# EAGLE design fb_up_2-4fach_tastsensor (EAGLE 5.00)
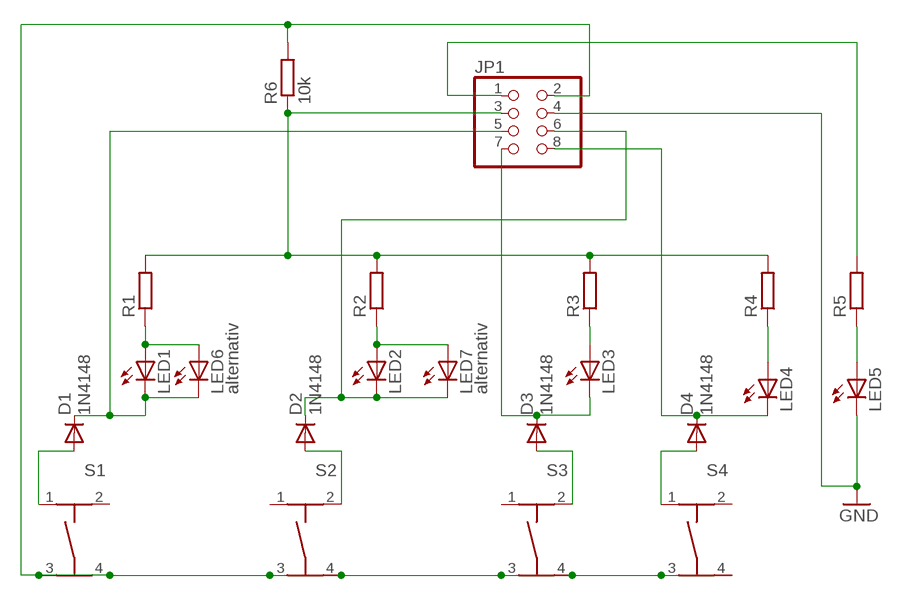
[diagram p0: schematic, sheet 1]

## Parts
D1  1N4148  [DO35-10]
D2  1N4148  [DO35-10]
D3  1N4148  [DO35-10]
D4  1N4148  [DO35-10]
JP1  PINHD-2X4  [2X04]
LED1  LED3MM  [LED3MM]
LED2  LED3MM  [LED3MM]
LED3  LED3MM  [LED3MM]
LED4  LED3MM  [LED3MM]
LED5  LED3MM  [LED3MM]
LED6  alternativ  LED3MM  [LED3MM]
LED7  alternativ  LED3MM  [LED3MM]
R1  R-EU_0204/7  [0204/7]
R2  R-EU_0204/7  [0204/7]
R3  R-EU_0204/7  [0204/7]
R4  R-EU_0204/7  [0204/7]
R5  R-EU_0204/7  [0204/7]
R6  10k  R-EU_0204/7  [0204/7]
S1  TASTER-9314_SMD  [TASTER-9314_SMD]
S2  TASTER-9314_SMD  [TASTER-9314_SMD]
S3  TASTER-9314_SMD  [TASTER-9314_SMD]
S4  TASTER-9314_SMD  [TASTER-9314_SMD]

## Nets
GND: JP1.4 LED5.K(C)
N$4: JP1.1 R5.2
N$5: LED1.A LED6.A R1.1
N$6: LED2.A LED7.A R2.1
N$7: LED3.A R3.1
N$8: LED4.A R4.1
N$9: LED5.A R5.1
N$10: JP1.3 R1.2 R2.2 R3.2 R4.2 R6.1
N$11: D1.C JP1.5 LED1.K(C) LED6.K(C)
N$12: D2.C JP1.6 LED2.K(C) LED7.K(C)
N$13: D1.A S1.1
N$14: D4.C JP1.8 LED4.K(C)
N$15: JP1.2 R6.2 S1.3 S1.4 S2.3 S2.4 S3.3 S3.4 S4.3 S4.4
N$17: D2.A S2.2
N$19: D3.C JP1.7 LED3.K(C)
N$21: D3.A S3.2
N$23: D4.A S4.1
Unconnected: S1.2 S2.1 S3.1 S4.2

## Library data of the parts
D1-D4 = diode:1N4148: DIODE high speed (Philips)
JP1 = pinhead:PINHD-2X4: PIN HEADER
LED1-LED7 = led:LED: LED OSRAM: - CHIPLED LG R971, LG N971, LY N971, LG Q971, LY Q971, LO R971, LY R971 LH N974, LH R974 LS Q976, LO Q976, LY Q976 LO Q996 - Hyper CHIPLED LW Q18S LB Q993, LB Q99A, LB R99A - SideLED LS A670, LO A670, LY A670, LG A670, LP A670 LB A673, LV A673, LT A673, LW A673 LH A674 LY A675 LS A676, LA A676, LO A676, LY A676, LW A676 LS A679, LY A679, LG A679 - Hyper Micro SIDELED® LS Y876, LA Y876, LO Y876, LY Y876 LT Y87S - SmartLED LW L88C, LW L88S LB L89C, LB L89S, LG L890 LS L89K, LO L89K, LY L89K LS L896, LA L896, LO L896, LY L896 - TOPLED LS T670, LO T670, LY T670, LG T670, LP T670 LSG T670, LSP T670, LSY T670, LOP T670, LYG T670 LG T671, LOG T671, LSG T671 LB T673, LV T673, LT T673, LW T673 LH T674 LS T676, LA T676, LO T676, LY T676, LB T676, LH T676, LSB T676, LW T676 LB T67C, LV T67C, LT T67C, LS T67K, LO T67K, LY T67K, LW E67C LS E67B, LA E67B, LO E67B, LY E67B, LB E67C, LV E67C, LT E67C LW T67C LS T679, LY T679, LG T679 LS T770, LO T770, LY T770, LG T770, LP T770 LB T773, LV T773, LT T773, LW T773 LH T774 LS E675, LA E675, LY E675, LS T675 LS T776, LA T776, LO T776, LY T776, LB T776 LHGB T686 LT T68C, LB T68C - Hyper Mini TOPLED® LB M676 - Mini TOPLED Santana® LG M470 LS M47K, LO M47K, LY M47K Source: http://www.osram.convergy.de/
R1-R6 = rcl:R-EU_: RESISTOR, European symbol
S1-S4 = Ergaenzung:TASTER-9314_SMD

## Board
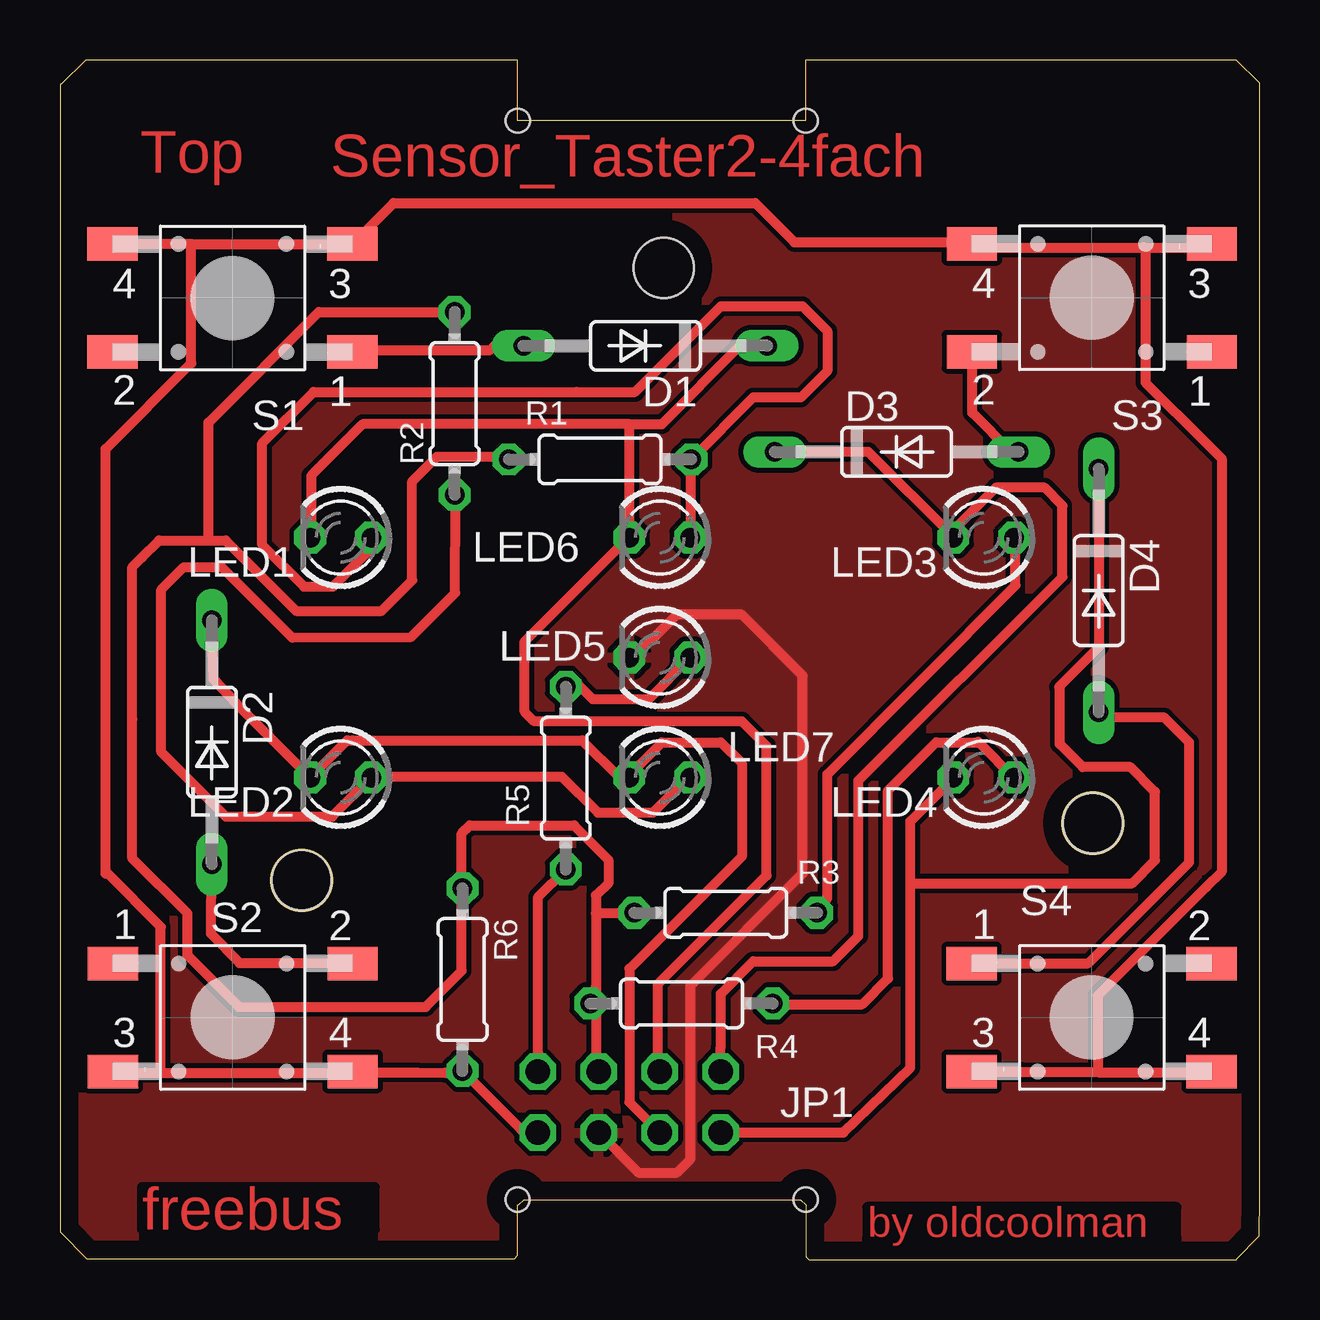
[diagram p1: board, top side]
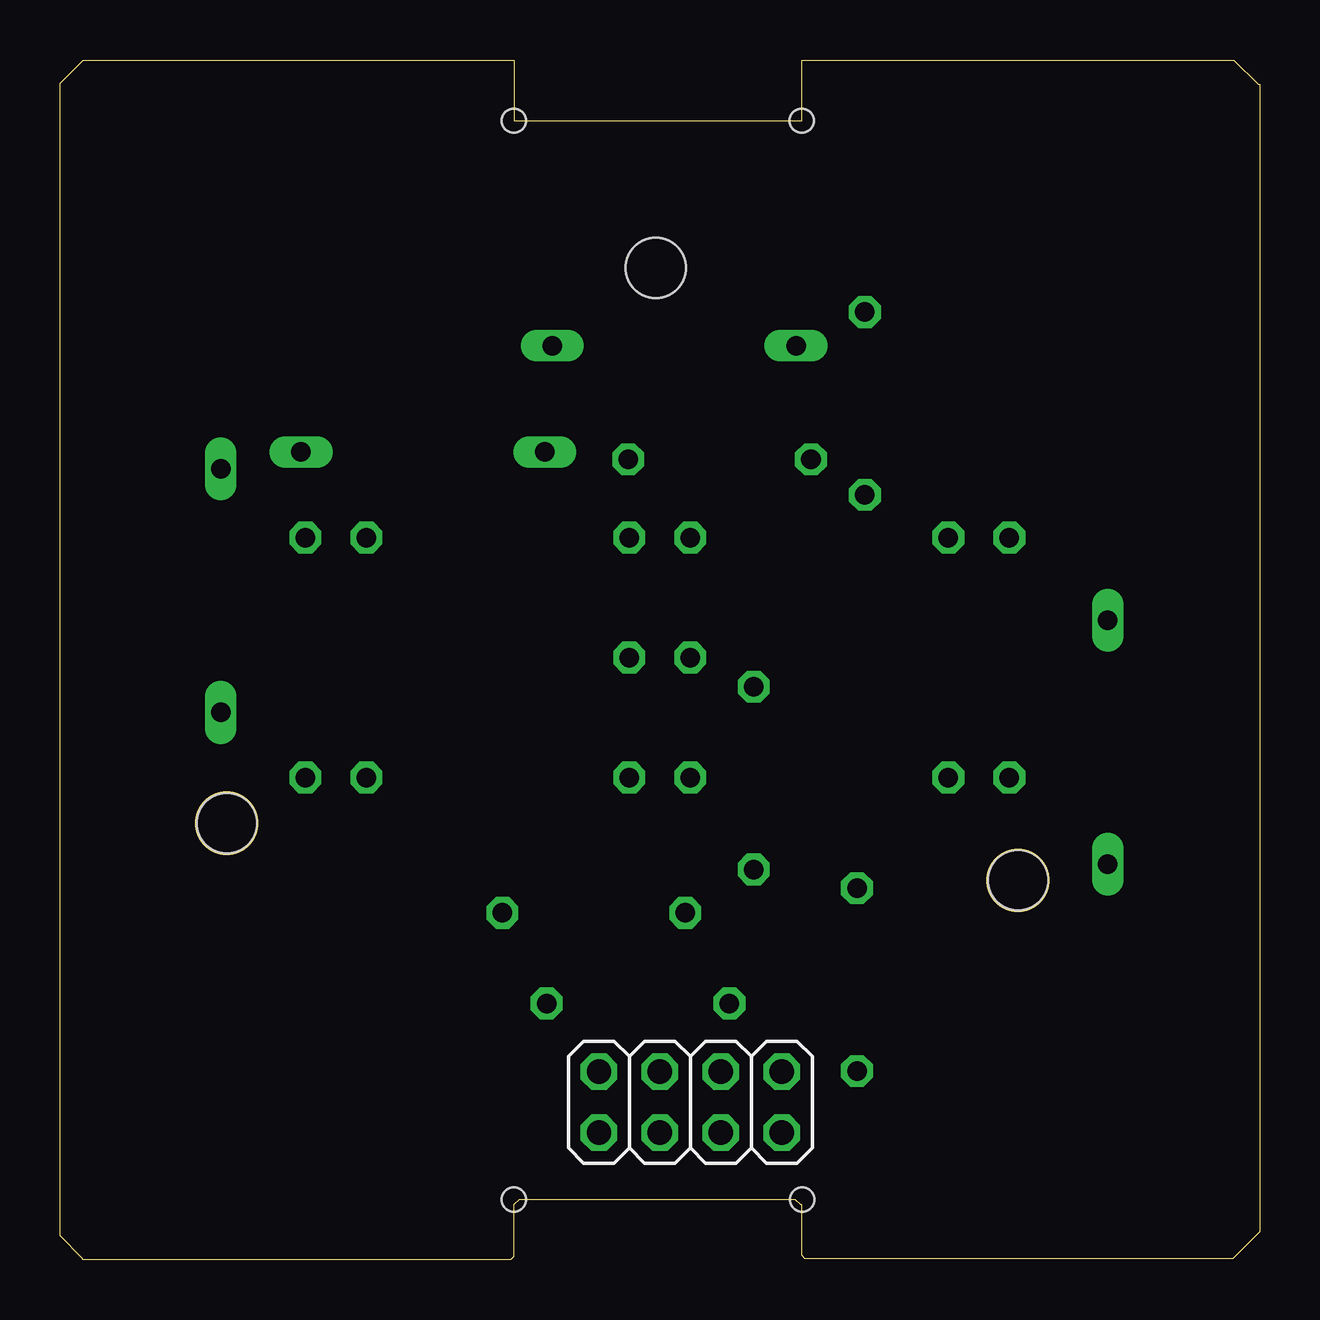
[diagram p2: board, bottom side, seen from below]

Size 50 x 50.01 mm. Coordinates in mm from the lower left corner, seen from the top.
Outline: 0,1.17 1.12,0.05 18.94,0.05 19.07,0.18 19.07,2.29 19.12,2.29 19.34,2.51 30.87,2.51 31.09,2.29 31.09,0.13 31.22,0 49.05,0 49.05,0.05 49.99,0.99 50,2.6 50,47.6 50,49.05 49.04,50.01 31.07,50.01 31.07,47.48 19.08,47.48 19.08,50.01 1.08,50.01 0.06,48.99 0,48.99 0,47.6 0,47.6 0,1.17
Outline: circle at 10.07,15.81 radius 1.3
Outline: circle at 43.05,18.2 radius 1.3
Copper layers (1*16): Top 0.035mm / dielectric 1.5mm / Bottom 0.035mm
Design rules "default *": minimum track width 10mil, minimum drill 24mil, track to track 8mil, track to pad 8mil, pad to pad 8mil, via to via 8mil, smd to smd 8mil, copper to edge 30mil, drill to drill 8mil, minimum pad ring 10mil, minimum via ring 8mil, stop-mask expansion 4mil, vias tented up to drill 0mil, thermal gap 10mil
Holes 2.5 mm at 25.16,41.34 10.07,15.82 43.05,18.2
Holes 1 mm at 19.09,47.48 31.08,47.48 19.07,2.51 31.08,2.51
tKeepout: area 30.4,20.6 to 31.7,23.8; area 18.2,20.5 to 19.5,30.5; area 0,19.8 to 5,29.8; area 14.5,19.8 to 19.5,29.8; area 30.4,19.8 to 35.4,29.8; area 45,19.8 to 50,29.8; area 0,2.6 to 50,5.3; area 0,44.9 to 50,47.6; area 22.6,40.9 to 27.6,41.9; area 9.5,13.6 to 10.6,18; area 42.5,16 to 43.5,20.4; area 0,2.6 to 2.2,47.6; 1 more areas
bKeepout: area 16.3,46.6 to 33.8,47.6; area 46,2.7 to 50,47.6; area 0,2.6 to 49.9,3.6; area 0,2.7 to 4.2,47.6; area 4.1,40.9 to 10.4,47.5; area 10.4,44.3 to 13.8,47.6; area 13.8,45.8 to 15.5,47.6; area 4.2,37.6 to 7,40.9; area 4.2,36 to 5.4,37.5; area 7.1,39.2 to 8.6,40.8; area 10.4,42.5 to 12.1,44.3; area 4.1,3.4 to 9.2,10.3; 25 more areas; 10 lines

### Footprints (pad centres in the part's own frame; a part is rotated, then mirrored left to right if it is on the bottom)
DO35-10 = drill 0.813 long: A 5.08,0; C -5.08,0
2X04 = drill 1.016 octagon: 1 -3.81,-1.27; 2 -3.81,1.27; 3 -1.27,-1.27; 4 -1.27,1.27; 5 1.27,-1.27; 6 1.27,1.27; 7 3.81,-1.27; 8 3.81,1.27
LED3MM = drill 0.813 octagon: A -1.27,0; K 1.27,0
0204/7 = drill 0.813 octagon: 1 -3.81,0; 2 3.81,0
TASTER-9314_SMD = smd 2.1 x 1.4: 1 -5,2.25; 2 5,2.25; 3 -5,-2.25; 4 5,-2.25

### Placement (x,y rotation side)
D1  24.4,38.09 180 top
D2  6.33,21.58 270 top
D3  34.87,33.67 0 top
D4  43.3,27.89 270 top
JP1  23.72,6.57 180 bottom
LED1  11.7,30.1 180 top
LED2  11.7,20.1 180 top
LED3  38.5,30.1 180 top
LED4  38.5,20.1 180 top
LED5  25,25.1 180 top
LED6  25,30.1 180 top
LED7  25,20.1 180 top
R1  22.51,33.36 180 top
R2  16.45,35.69 90 top
R3  27.75,14.46 180 top
R4  25.91,10.69 180 top
R5  21.09,20.08 270 top
R6  16.78,11.68 270 top
S1  7.19,40.09 180 top
S2  7.2,10.1 0 top
S3  43.01,40.1 180 top
S4  43,10.1 0 top

### Tracks (layer width: path | path; a pad name or v marks a point on that pad's centre or on a via)
GND
  Top 0.406: LED5.K 23.93,25.1 25.72,26.89 28.42,26.89 30.96,24.35 30.96,16.09 26.27,11.41 26.27,4.19 25.72,3.63 24.12,3.63 JP1.4
  pour Top: -0.95,50.94 51.59,50.94 51.59,-0.42 -0.79,-0.42 -0.79,31.41
N$1  (via drill 0.6)
  other vias: 25.14,41.33
N$2  (via drill 0.6)
  other vias: 10.07,15.81
N$3  (via drill 0.6)
  other vias: 43.05,18.2
N$4
  Top 0.406: R5.2 19.93,15.12 19.93,8.61 JP1.1
N$5
  Top 0.406: 13.08,30.12 12.99,30.12 LED1.A 12.95,30.12 | LED6.A 26.28,33.04 26.28,33.31 26.27,33.32 R1.1 28.89,35.94 30.88,35.94 31.99,37.05 31.99,38.72 30.96,39.75 27.54,39.75 23.97,36.17 21.55,36.17 10.56,36.17 8.43,34.03 8.43,29.8 10.17,28.05 11.38,28.05 12.95,29.62 12.95,30.12 | 12.95,30.12 12.95,30.21
N$6
  Top 0.406: LED7.A 26.29,20.09 26.29,19.98 26.06,19.98 24.72,18.64 22.42,18.64 20.91,20.14 13.01,20.14 LED2.A 11.35,18.48 6.91,18.48 4.22,21.16 4.22,27.93 5.16,28.87 6.75,28.87 9.68,25.94 14.64,25.97 16.47,27.79 16.49,31.67 16.45,31.83 R2.1
N$7
  Top 0.406: R3.1 31.98,15.07 31.98,20.23 39.83,28.11 39.83,30.04 LED3.A
N$8
  Top 0.406: R4.1 30.08,10.65 33.44,10.65 34.51,11.73 34.51,19.57 36.51,21.57 38.26,21.57 38.27,21.58 38.27,21.59 39.83,20.03 39.73,20.03 39.73,20.06 LED4.A
N$9
  Top 0.406: LED5.A 24.54,23.37 22.2,23.37 21.66,23.91 21.11,23.91 R5.1
N$10
  Top 0.406: 22.34,11.32 22.34,11.39 | JP1.3 22.34,8.35 22.34,11.32 | 22.34,11.32 R4.2 | 22.34,14.45 22.34,15.19 22.86,15.69 22.86,16.67 21.43,18.11 17.09,18.11 16.75,17.76 16.75,15.49 R6.1 16.75,15.46 16.75,12.05 15.24,10.54 7.46,10.54 5.32,12.68 5.32,14.43 3.02,16.73 3.02,22.52 3.02,28.87 3.41,29.27 | 22.34,14.45 22.34,11.32 | 22.34,14.45 22.51,14.45 | R3.2 23.21,14.45 22.34,14.45 | R1.2 18.7,33.43 18.65,33.48 15.72,33.48 14.68,32.45 14.68,28.32 13.41,27.05 9.84,27.05 6.91,29.98 6.19,29.98 | R2.2 10.79,39.5 6.19,34.91 6.19,29.98 | 6.19,29.98 4.13,29.98 3.41,29.27 | 3.41,29.27
N$11
  Top 0.406: LED1.K 10.4,30.14 10.48,30.22 10.48,32.68 12.62,34.83 23.73,34.83 | 24.98,8.19 24.9,7.9 JP1.5 25,7.92 24.93,7.6 24.93,11.49 29.45,16.01 29.45,21.41 28.42,22.44 19.77,22.44 19.37,22.84 19.37,25.78 23.73,30.14 | D1.C 28.35,38.09 25.08,34.83 23.73,34.83 | 23.73,34.83 23.73,34.75 23.73,34.74 LED6.K 23.73,30.14 | 23.73,30.14
N$12
  Top 0.406: D2.C 6.41,24.19 7.36,23.17 LED2.K 11.72,21.39 11.97,21.65 12.2,21.65 21.77,21.65 23.28,20.14 23.71,20.14 23.71,20.13 LED7.K 23.73,20.22 25.08,21.57 27.54,21.57 28.42,20.7 28.42,16.81 23.73,12.12 23.73,6.57 24.93,5.38 JP1.6
N$13
  Top 0.406: S1.1 | S1.1 12.89,37.9 | D1.A 18.11,38.09 17.94,37.92 12.3,37.92 12.19,37.81 | 12.19,37.81 12.14,37.76 | S1.1 12.19,37.81
N$14
  Top 0.406: JP1.8 27.52,5.31 32.66,5.31 35.44,8.01 35.44,15.7 | D4.C 43.33,32.29 43.33,25.56 41.64,23.87 41.67,23.87 41.67,21.49 42.62,20.54 44.61,20.54 45.64,19.51 45.64,16.65 44.69,15.7 35.44,15.7 | LED4.K 37.23,20.07 35.44,18.27 35.44,15.7
N$15
  Top 0.406: S2.3 2.25,7.8 4.21,7.8 | 4.21,7.8 12.15,7.8 S2.4 13.27,7.81 14.92,7.81 16.04,7.8 16.84,7.8 16.84,7.81 R6.2 19.21,5.44 19.85,5.44 | 19.85,5.44 19.86,5.36 | 19.85,5.44 JP1.2 19.95,5.34 19.87,5.46 | 5.48,42.34 S1.4 | 5.48,42.34 S1.3 | S1.3 13.9,44.05 28.98,44.05 30.61,42.42 37.94,42.42 S3.4 38.18,42.18 45.16,42.18 | 48.18,42.18 48.2,42.18 | 48.18,42.18 S3.3 | 45.16,42.18 48.18,42.18 | S4.4 47.97,7.82 43.26,7.82 | 43.26,7.82 38.03,7.82 S4.3 40.02,7.85 | S1.3 11.72,42.34 | 45.16,42.18 45.16,42.21 45.24,42.13 45.24,36.57 47.78,34.03 48.42,33.4 48.42,16.17 47.78,15.54 | 5.48,42.34 5.48,37.37 1.91,33.79 1.91,16.09 1.98,16.09 4.21,13.87 4.21,7.8 | 47.78,15.54 | 47.78,15.54 43.26,11.01 43.26,7.82 | 47.78,15.54
N$17
  Top 0.406: S2.2 12.18,12.37 7.49,12.37 | 7.49,12.37 7.49,12.36 | D2.A 6.3,13.59 7.49,12.37
N$19
  Top 0.406: 27.45,7.76 JP1.7 27.53,8.86 27.54,8.87 27.54,11.09 28.89,12.44 32.23,12.44 33.27,13.49 33.27,19.97 41.79,28.46 41.79,31.43 41.04,32.18 39,32.18 37.28,30.46 37.28,30.15 LED3.K 37.23,30.14 33.7,33.67 D3.C
N$21
  Top 0.406: 38.18,37.68 S3.2 38.01,37.75 37.94,37.68 38.02,37.61 38.02,35.3 39.65,33.67 D3.A
N$23
  Top 0.406: 38.03,12.38 S4.1 38,12.3 38.02,12.28 38.1,12.36 42.86,12.36 47.07,16.57 47.07,21.57 46.04,22.6 43.26,22.6 43.29,22.58 D4.A

### Text on the board
Top: Top | Sensor_Taster2-4fach | freebus | by oldcoolman